# EAGLE design Puzzle LED Strip driver (EAGLE 6.2)
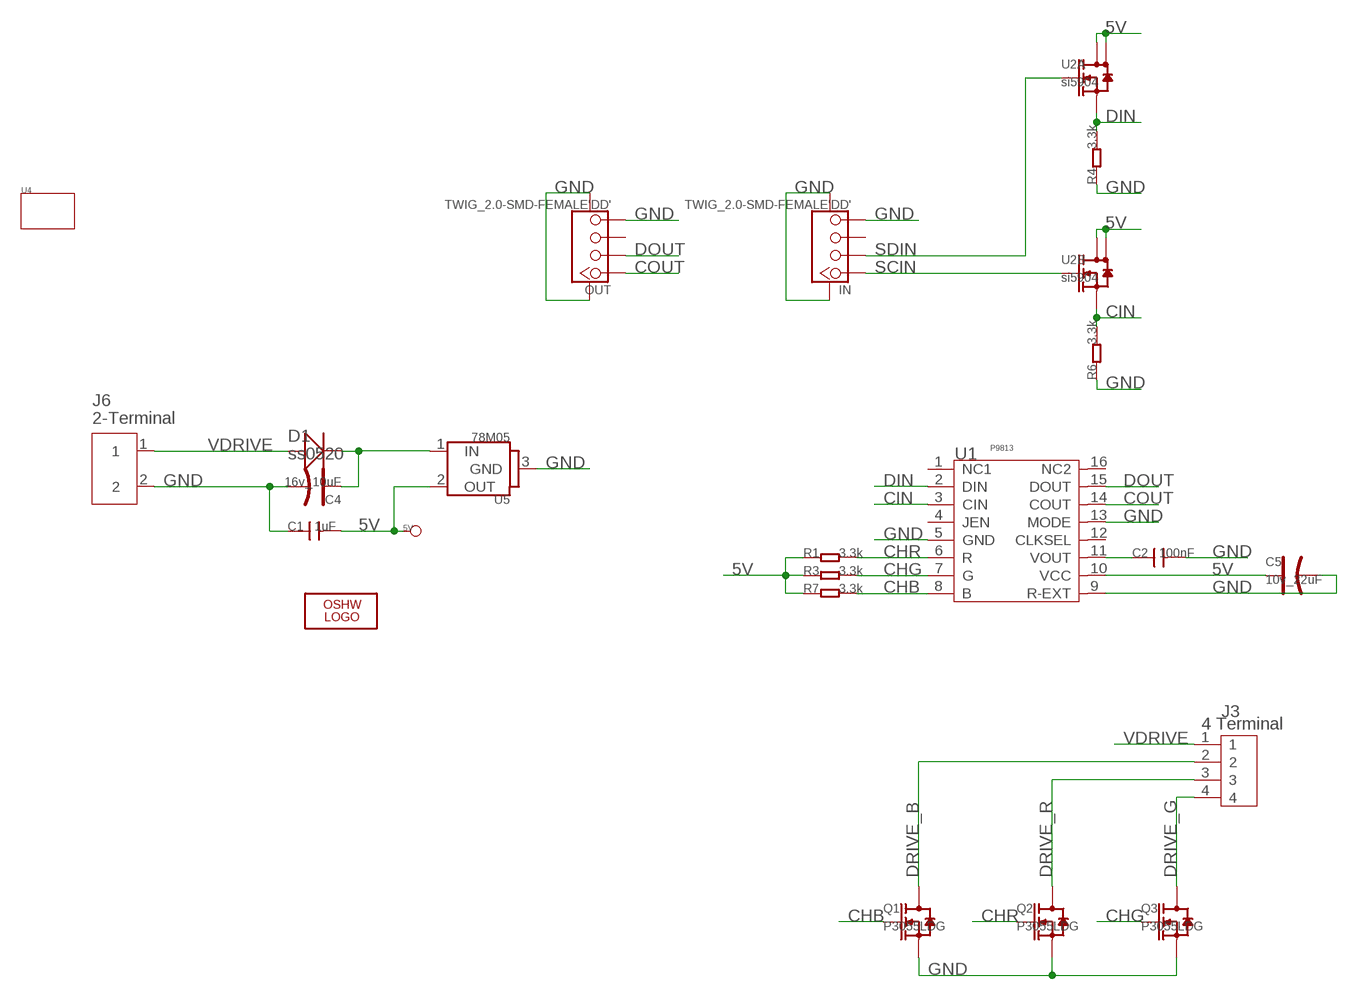
[diagram p0: schematic, sheet 1]

## Parts
5V  DNP  PAD-TEST-POINT-CIRCLE_SIZE_3030  [TP_3535]
C1  1uF  C-0805  [0805]
C2  100nF  C-0402  [0402]
C4  16v_10uF  CAP-AVX-A  [AVX-A]
C5  10v_22uF  CAP-AVX-A  [AVX-A]
D1  ss0520  D'1206'  [SOD123]
IN  TWIG_2.0-SMD-FEMALE'DD'  [2.0_1X4DD]
J3  4 Terminal  SCREW-TERMINAL-4P'3.36'  [4P-3.36]
J6  2-Terminal  SCREW-TERMINAL-2P3.36  [2P-3.36]
LOGO1  LOGO-OSHW-FILLX0200-NT  [OSHW_FILLX200_NOTEXT]
OUT  TWIG_2.0-SMD-FEMALE'DD'  [2.0_1X4DD]
Q1  P3055LDG  MOSFET-N-P3055LDG  [TO252]
Q2  P3055LDG  MOSFET-N-P3055LDG  [TO252]
Q3  P3055LDG  MOSFET-N-P3055LDG  [TO252]
R1  3.3k  R-0402  [0402]
R3  3.3k  R-0402  [0402]
R4  3.3k  R-0402  [0402]
R6  3.3k  R-0402  [0402]
R7  3.3k  R-0402  [0402]
U1  P9813  P9813-SSOP16  [SSOP16]
U2  si5904  MOSFET-DUAL-N-1206-8  [1206-8]
U4  TWIG3U-W/O-DRILL  [3U-DIM-W/O-DRILL]
U5  78M05  78M05-TO252  [TO252]

## Nets
5V: 5V.T C1.2 C5.+ R1.1 R3.1 R7.1 U1.10(VCC) U2.5(B:D) U2.6(B:D) U2.7(A:D) U2.8(A:D) U5.2(OUT)
CHB: Q1.1(G) R7.2 U1.8(B)
CHG: Q3.1(G) R3.2 U1.7(G)
CHR: Q2.1(G) R1.2 U1.6(R)
CIN: R6.2 U1.3(CIN) U2.3(B:S)
COUT: OUT.1 U1.14(COUT)
DIN: R4.2 U1.2(DIN) U2.1(A:S)
DOUT: OUT.2 U1.15(DOUT)
DRIVE_B: J3.2 Q1.2(D)
DRIVE_G: J3.4 Q3.2(D)
DRIVE_R: J3.3 Q2.2(D)
GND: C1.1 C2.2 C4.- C5.- IN.4 IN.SS1 IN.SS2 J6.2 OUT.4 OUT.SS1 OUT.SS2 Q1.3(S) Q2.3(S) Q3.3(S) R4.1 R6.1 U1.5(GND) U1.9(R-EXT) U1.13(MODE) U5.3(GND)
N$1: C2.1 U1.11(VOUT)
N$2: C4.+ D1.- U5.1(IN)
SCIN: IN.1 U2.4(B:G)
SDIN: IN.2 U2.2(A:G)
VDRIVE: D1.+ J3.1 J6.1
Unconnected: IN.3 OUT.3 U1.1(NC1) U1.4(JEN) U1.12(CLKSEL) U1.16(NC2)

## Library data of the parts
5V = Discrete:PAD-TEST-POINT-CIRCLE
C1 C2 = Discrete:C*: Ceramic Capacitors
C4 C5 = Discrete:CAP*: Electrolytic Capacitors,Tantalum Capacitors and Super Capacitors
D1 = Discrete:D*
IN OUT = Connector:TWIG_2.0-SMD-FEMALE
J3 = Connector:SCREW-TERMINAL-4P
J6 = Connector:SCREW-TERMINAL-2P
LOGO1 = Logo:LOGO-OSHW-FILL
Q1-Q3 = Discrete:MOSFET-N: IRLL014: http://www.vishay.com/docs/91319/sihll014.pdf
R1 R3 R4 R6 R7 = Discrete:R*
U1 = IC:P9813-SSOP16
U2 = Discrete:MOSFET-DUAL-N: Si5902BDC/Si5904DC/Si5908DC/Si5920DC
U4 = Module:TWIG
U5 = IC:78M05: 0.5A Three Terminal Positive Voltage Regulators http://pdf1.alldatasheet.com/datasheet-pdf/view/31368/TOSHIBA/78M05/+21_79UPLRhpDDdCDytD+/datasheet.pdf

## Board
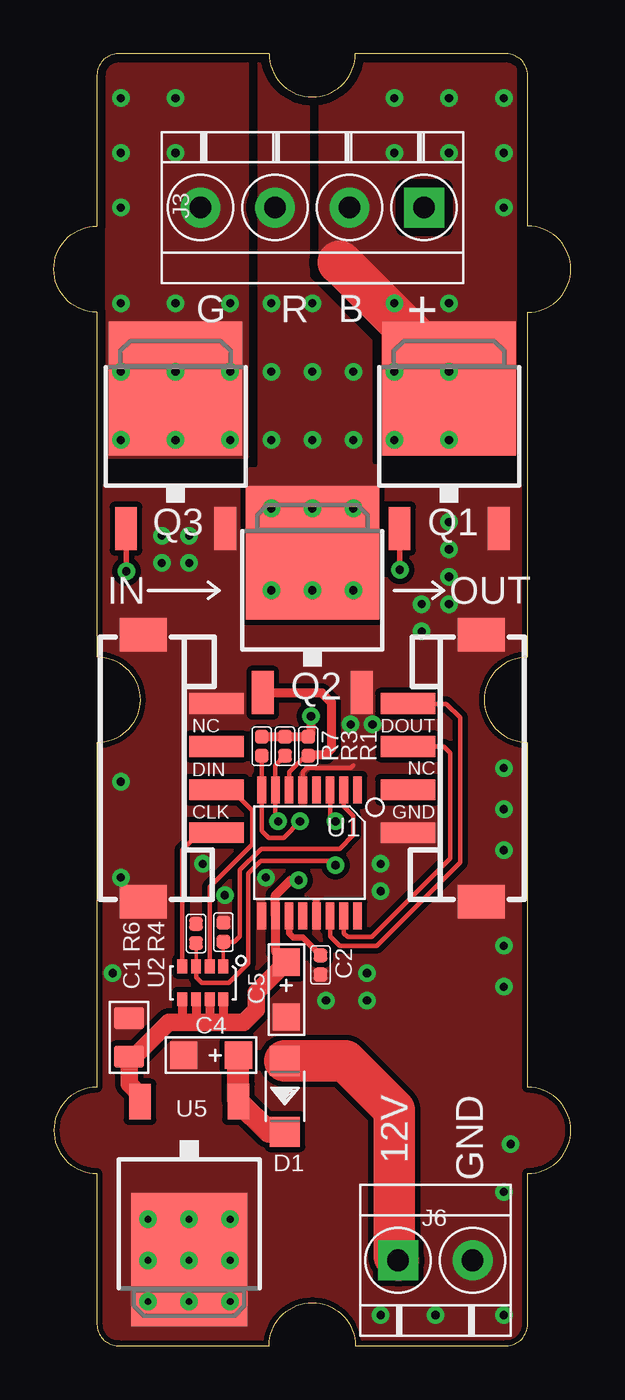
[diagram p1: board, top side]
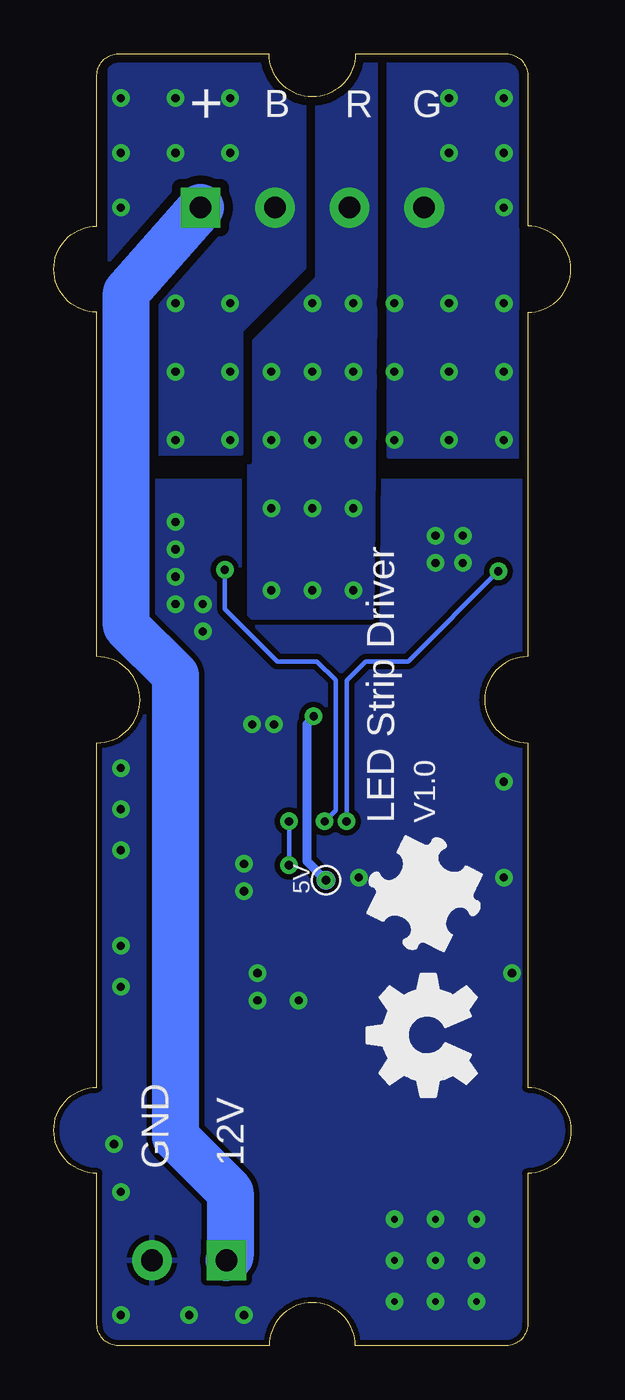
[diagram p2: board, bottom side, seen from below]

Size 24 x 60 mm. Coordinates in mm from the lower left corner, seen from the top.
Copper layers (1*16): Top 0.035mm / dielectric 1.5mm / Bottom 0.035mm
Design rules: minimum track width 6mil, minimum drill 12mil, track to track 6mil, track to pad 6mil, pad to pad 6mil, via to via 6mil, smd to smd 0mil, copper to edge 10mil, drill to drill 10mil, minimum pad ring 10mil, minimum via ring 6mil, stop-mask expansion 2mil, vias tented up to drill 100mil, thermal gap 10mil

### Footprints (pad centres in the part's own frame; a part is rotated, then mirrored left to right if it is on the bottom)
TP_3535 = smd 0.889 x 0.889: T 0,0
0805 = smd 1.016 x 1.397: 1 -0.889,0; 2 0.889,0
0402 = smd 0.635 x 0.635: 1 -0.445,0; 2 0.445,0
AVX-A = smd 1.27 x 1.27: + -1.27,0; - 1.27,0
SOD123 = smd 1.397 x 1.397: + 1.651,0; - -1.651,0
2.0_1X4DD = smd 0.965 x 2.54: 1 -3,0; 2 -1,0; 3 1,0; 4 3,0 | smd 1.55 x 2.184: SS1 -6.2,3.4; SS2 6.2,3.4
4P-3.36 = drill 1 pad 1.85 square: 1 -5.19,0 | drill 1 pad 1.85: 2 -1.73,0; 3 1.73,0; 4 5.19,0
2P-3.36 = drill 1 pad 1.85 square: 1 -1.73,0 | drill 1 pad 1.85: 2 1.73,0
TO252 = smd 1.016 x 2: 1 -2.3,-4.75; 3 2.3,-4.75 | smd 6.2 x 6.2: 2 0,1.75
SSOP16 = smd 0.406 x 1.27: 1 -2.223,-2.925; 2 -1.587,-2.925; 3 -0.953,-2.925; 4 -0.318,-2.925; 5 0.318,-2.925; 6 0.953,-2.925; 7 1.587,-2.925; 8 2.223,-2.925; 9 2.223,2.925; 10 1.587,2.925; 11 0.953,2.925; 12 0.318,2.925; 13 -0.318,2.925; 14 -0.953,2.925; 15 -1.587,2.925; 16 -2.223,2.925
1206-8 = smd 0.457 x 0.635: 1 -0.953,-0.762; 2 -0.318,-0.762; 3 0.318,-0.762; 4 0.953,-0.762; 5 0.953,0.762; 6 0.318,0.762; 7 -0.318,0.762; 8 -0.953,0.762
TO252' = smd 1.016 x 1.651: 1 -2.286,-4.826; 2 2.286,-4.826 | smd 5.4 x 6.2: 3 0,2.5

### Placement (x,y rotation side)
5V  11.37,21.62 0 bottom
C1  3.49,14.32 270 top
C2  12.38,17.68 270 top
C4  7.3,13.49 180 top
C5  10.79,16.54 270 top
D1  10.73,11.59 90 top
IN  7.56,26.82 90 top
J3  12,52.86 180 top
J6  17.71,3.96 0 top
LOGO1  4.38,11.59 90 bottom
OUT  16.45,26.82 270 top
Q1  18.35,42.7 0 top
Q2  12,35.08 0 top
Q3  5.65,42.7 0 top
R1  11.81,27.84 270 top
R3  10.73,27.84 270 top
R4  7.87,19.2 270 top
R6  6.6,19.14 270 top
R7  9.65,27.84 270 top
U1  11.87,22.89 180 top
U2  6.92,16.86 180 top
U4  12,30 90 top
U5  78M05  [TO252']  6.29,6.51 180 top
U$2  [BRICK-LOGO-2-B-MIL-0.6]  3.75,17.93 0 top

### Tracks (layer width: path | path; a pad name or v marks a point on that pad's centre or on a via)
5V  (via drill 0.38 pad 0.81)
  Top 0.406: C5.+ 10.29,18.32 U1.10 10.29,20.92 10.98,21.62 5V.T | U2.7 7.24,15.01 | U2.6 6.6,15.01 | U2.5 5.97,15.01 | U2.8 7.87,15.01 | R7.1 R3.1 R1.1 | v11.94,29.24 11.94,28.41 R1.1 | R1.1 11.75,28.22
  Top 0.813: U5.2 4,11.65 3.49,12.16 C1.2 3.49,13.49 3.56,13.43 3.62,13.49 3.81,13.49 5.33,15.01 5.97,15.01 6.6,15.01 7.24,15.01 7.87,15.01 8.83,15.01 9.4,15.59 9.4,16.41 C5.+
  Bottom 0.406: v11.94,29.24 11.94,29.17 12.25,28.86 12.25,22.51 5V.T
  other vias: 11.37,21.62
CHB  (via drill 0.38 pad 0.81)
  Top 0.152: Q1.1 16.06,37.94
  Top 0.203: R7.2 U1.8 9.65,23.9 9.97,23.59 10.67,23.59 v11.43,24.35
  Top 0.254: v16.06,36.03 16.06,37.94
  Bottom 0.203: v16.06,36.03 16.06,34.22 13.62,31.78 11.78,31.78 10.92,30.91 10.92,24.86 v11.43,24.35
CHG  (via drill 0.38 pad 0.81)
  Top 0.203: v10.41,24.35 10.29,24.48 U1.7 10.29,26.95 R3.2 | 3.35,35.98 v3.36,35.97
  Top 0.254: Q3.1 3.35,35.98
  Bottom 0.203: v10.41,24.35 10.41,30.89 9.52,31.78 7.56,31.78 v3.36,35.97
CHR
  Top 0.152: R1.2 11.75,27.46
  Top 0.203: U1.6 10.92,26.63 11.75,27.46
  Top 0.406: Q2.1 9.71,30.32 12.45,30.32 12.89,29.87 12.89,27.71 12.64,27.46 11.75,27.46 | R1.2 11.87,27.46
CIN  (via drill 0.38 pad 0.81)
  Top 0.152: R6.2 U2.3
  Top 0.203: U2.3 6.6,17.11 6.86,16.86 8.13,16.86 9.02,17.74 9.02,21.92 9.6,22.51 12.89,22.51 v13.08,22.32 | U1.3 12.83,24.6 v13.08,24.35
  Bottom 0.203: v13.08,24.35 v13.08,22.32
COUT
  Top 0.152: OUT.1
  Top 0.203: U1.14 12.83,19.02 13.27,18.57 14.98,18.57 18.86,22.44 18.86,29.17 18.22,29.81 OUT.1
DIN
  Top 0.152: R4.2 U2.1 | 13.4,25.81 U1.2
  Top 0.203: R4.2 8.38,18.76 8.64,19.02 8.64,22.09 9.62,23.08 13.27,23.08 13.91,23.71 13.91,24.6 13.46,25.05 13.46,25.75 13.4,25.81
DOUT
  Top 0.203: U1.15 13.46,19.16 13.64,18.98 14.76,18.98 18.41,22.63 18.41,27.52 18.1,27.84 16.46,27.84 OUT.2
DRIVE_B  (via drill 0.38 pad 0.81)
  Top 2.032: Q1.2 v18.35,45.24 13.27,50.32
  other vias: 18.35,48.41 18.35,42.06 15.81,42.06 15.81,45.24 15.81,48.41 18.35,55.4 18.35,57.94 20.89,57.94 20.89,55.4 20.89,52.86 15.81,57.94 15.81,55.4
  pour Top (isolate 0.406, rank 2, no thermals): 15.3,41.43 15.3,47.15 12.38,50.07 12.38,59.72 21.4,59.72 21.4,41.43
  pour Bottom (isolate 0.406, rank 2, no thermals): 15.3,41.43 15.3,47.15 12.38,50.07 12.38,59.72 21.4,59.72 21.4,41.43
DRIVE_G  (via drill 0.38 pad 0.81)
  other vias: 8.19,48.41 8.19,45.24 8.19,42.06 5.65,42.06 5.65,45.24 3.11,45.24 3.11,42.06 5.65,48.41 3.11,48.41 3.11,52.86 5.65,55.4 3.11,55.4 3.11,57.94 5.65,57.94
  pour Top (isolate 0.406, rank 2, no thermals): 2.48,41.3 8.95,41.3 8.95,59.84 2.48,59.84
  pour Bottom (isolate 0.406, rank 2, no thermals): 2.48,41.3 8.44,41.3 8.44,59.84 2.48,59.84
DRIVE_R  (via drill 0.38 pad 0.81)
  other vias: 12,38.89 12,35.08 12,42.06 12,45.24 12,48.41 10.1,48.41 10.1,45.24 13.91,45.24 13.91,42.06 10.1,42.06 13.91,38.89 10.1,38.89 13.91,35.08 10.1,35.08
  pour Top (isolate 0.406, rank 3, no thermals): 11.87,59.72 8.95,59.72 9.21,33.81 14.92,33.81 14.92,47.02 11.87,50.07
  pour Top (isolate 0.406, rank 3, no thermals): 11.87,59.72 8.95,59.72 9.21,33.81 14.92,33.81 14.92,47.02 11.87,50.07
  pour Top (isolate 0.406, rank 3, no thermals): 11.87,59.72 8.95,59.72 9.21,33.81 14.92,33.81 14.92,47.02 11.87,50.07
  pour Bottom (isolate 0.406, rank 3, no thermals): 11.87,59.72 8.95,59.72 9.21,33.81 14.92,33.81 14.92,47.02 11.87,50.07
GND  (via drill 0.3 pad 0.81, 0.38 pad 0.81)
  Top 0.203: U1.5 11.56,26.63 11.75,26.82 13.78,26.82 13.91,26.95
  Top 0.305: U1.13 12.19,20.67
  other vias: 9.84,21.75 7.94,20.92 6.92,22.38 20.89,26.82 3.11,26.19 6.29,36.35 6.29,5.87 6.29,3.96 6.29,2.06 4.38,5.87 4.38,3.96 4.38,2.06 8.19,2.06 8.19,3.96 8.19,5.87 5.02,36.35 6.29,37.62 5.02,37.62 18.35,36.98 18.35,38.26 18.35,35.72 18.35,34.45 17.08,34.45 17.08,33.17 13.78,28.86 14.79,28.86 3.11,21.75 20.89,24.92 20.89,16.66 2.73,17.3 20.89,7.14 20.89,1.42 17.71,1.42 15.18,1.42 21.21,9.36 12.64,16.03 14.54,17.3 14.54,16.03 15.18,21.11 15.18,22.38 20.89,23.02 20.89,18.57
  pour Top (isolate 0.254, rank 6, no thermals): -0.7,39.91 24.07,39.91 24.07,-1.75 -0.7,-1.75
  pour Bottom (isolate 0.254, rank 6): -0.7,-1.75 -0.7,40.16 24.07,40.16 24.07,-1.75
N$1
  Top 0.305: U1.11 10.92,19.14 11.11,18.95 11.56,18.95 C2.1
N$2
  Top 1.016: D1.- 9.97,9.93 U5.1 C4.+
SCIN
  Top 0.203: IN.1 7.54,23.84 6.79,23.84 5.97,23.02 U2.4
SDIN
  Top 0.203: IN.2 7.57,25.81 8.25,25.81 9.21,24.86 9.21,23.27 7.24,21.3 U2.2
VDRIVE
  Top 1.93: D1.+ 13.52,13.24 15.81,10.95 15.81,4.14 J6.1
  Bottom 1.93: 15.81,4.14 J6.1
  Bottom 2.184: 15.81,4.14 15.81,7.14 18.35,9.68 18.35,31.14 20.64,33.43 20.64,48.92 J3.1

### Text on the board
tPlace: G | R | B | + | DOUT | NC | NC | DIN | GND | CLK | 12V | GND
bPlace: G | R | B | + | V1.0 | LED Strip Driver | 12V | GND
tStop: GND | CLK